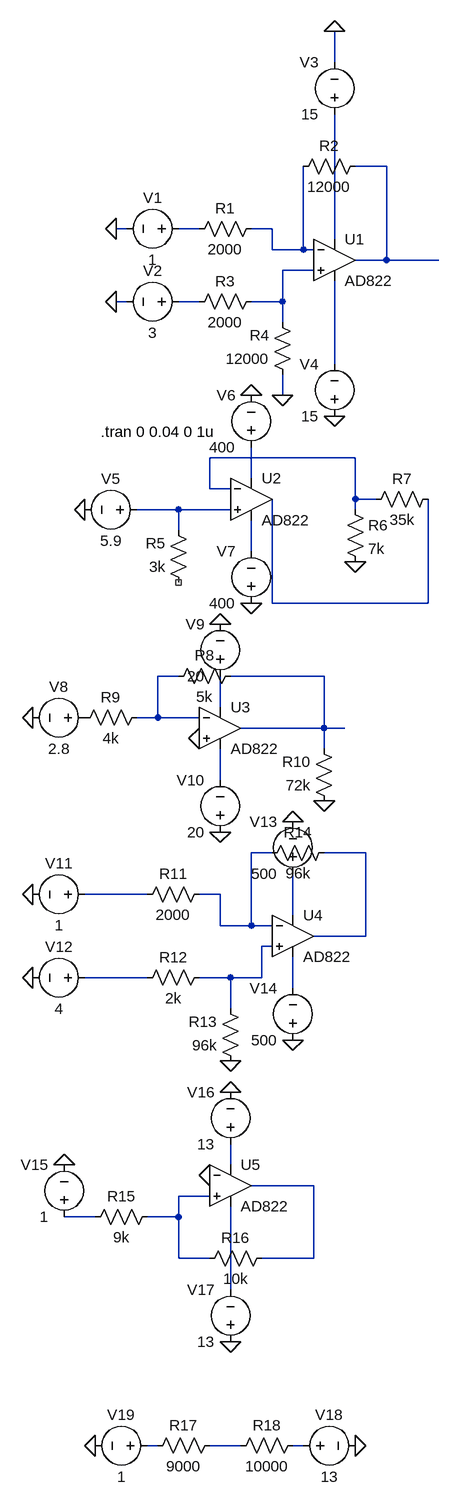
[diagram p0: schematic Draft1.asc]
Draft1.asc, the LTspice schematic file:
Version 4.1
SHEET 1 880 2000
WIRE 368 -192 368 -240
WIRE 448 -32 400 -32
WIRE 48 64 32 64
WIRE 160 64 128 64
WIRE 272 64 240 64
WIRE 368 80 368 -112
WIRE 272 96 272 64
WIRE 320 96 320 -32
WIRE 320 96 272 96
WIRE 336 96 320 96
WIRE 448 112 448 -32
WIRE 448 112 400 112
WIRE 528 112 448 112
WIRE 336 128 288 128
WIRE 48 176 32 176
WIRE 160 176 128 176
WIRE 288 176 288 128
WIRE 288 176 240 176
WIRE 288 208 288 176
WIRE 368 272 368 144
WIRE 288 320 288 288
WIRE 400 416 176 416
WIRE 240 448 240 400
WIRE 176 464 176 416
WIRE 208 464 176 464
WIRE 400 480 400 416
WIRE 432 480 400 480
WIRE 128 496 64 496
WIRE 208 496 128 496
WIRE 400 496 400 480
WIRE 128 528 128 496
WIRE 240 560 240 512
WIRE 272 640 272 480
WIRE 512 640 512 480
WIRE 512 640 272 640
WIRE 128 752 96 752
WIRE 352 752 208 752
WIRE 192 800 192 752
WIRE 96 816 96 752
WIRE 96 816 64 816
WIRE 160 816 96 816
WIRE 352 832 352 752
WIRE 352 832 224 832
WIRE 384 832 352 832
WIRE 352 864 352 832
WIRE 192 912 192 864
WIRE 272 1024 240 1024
WIRE 416 1024 352 1024
WIRE 80 1088 -16 1088
WIRE 192 1088 160 1088
WIRE 304 1120 304 1056
WIRE 192 1136 192 1088
WIRE 240 1136 240 1024
WIRE 240 1136 192 1136
WIRE 272 1136 240 1136
WIRE 416 1152 416 1024
WIRE 416 1152 336 1152
WIRE 272 1168 256 1168
WIRE 80 1216 -16 1216
WIRE 208 1216 160 1216
WIRE 256 1216 256 1168
WIRE 256 1216 208 1216
WIRE 304 1232 304 1184
WIRE 208 1264 208 1216
WIRE 208 1504 208 1472
WIRE 336 1536 240 1536
WIRE 176 1552 128 1552
WIRE 0 1584 -48 1584
WIRE 128 1584 128 1552
WIRE 128 1584 80 1584
WIRE 128 1648 128 1584
WIRE 176 1648 128 1648
WIRE 336 1648 336 1536
WIRE 336 1648 256 1648
WIRE 208 1696 208 1568
WIRE 96 1936 80 1936
WIRE 224 1936 176 1936
WIRE 320 1936 304 1936
FLAG 368 352 0
FLAG 368 -240 0
FLAG 32 64 0
FLAG 32 176 0
FLAG 288 320 0
FLAG -16 496 0
FLAG 400 576 0
FLAG 240 320 0
FLAG 240 640 0
FLAG 160 848 0
FLAG -96 816 0
FLAG 352 944 0
FLAG 192 672 0
FLAG 192 992 0
FLAG -96 1088 0
FLAG -96 1216 0
FLAG 208 1344 0
FLAG 304 976 0
FLAG 304 1312 0
FLAG 176 1520 0
FLAG 208 1776 0
FLAG 208 1392 0
FLAG -48 1504 0
FLAG 0 1936 0
FLAG 400 1936 0
SYMBOL voltage 144 64 R90
WINDOW 0 -32 56 VBottom 2
WINDOW 3 32 56 VTop 2
WINDOW 123 0 0 Left 0
WINDOW 39 0 0 Left 0
SYMATTR InstName V1
SYMATTR Value 1
SYMBOL voltage 144 176 R90
WINDOW 0 -32 56 VBottom 2
WINDOW 3 32 56 VTop 2
WINDOW 123 0 0 Left 0
WINDOW 39 0 0 Left 0
SYMATTR InstName V2
SYMATTR Value 3
SYMBOL res 256 160 R90
WINDOW 0 0 56 VBottom 2
WINDOW 3 32 56 VTop 2
SYMATTR InstName R3
SYMATTR Value 2000
SYMBOL res 256 48 R90
WINDOW 0 0 56 VBottom 2
WINDOW 3 32 56 VTop 2
SYMATTR InstName R1
SYMATTR Value 2000
SYMBOL res 304 304 R180
WINDOW 0 36 76 Left 2
WINDOW 3 36 40 Left 2
SYMATTR InstName R4
SYMATTR Value 12000
SYMBOL res 304 -16 R270
WINDOW 0 32 56 VTop 2
WINDOW 3 0 56 VBottom 2
SYMATTR InstName R2
SYMATTR Value 12000
SYMBOL OpAmps\\AD822 368 48 R0
SYMATTR InstName U1
SYMBOL voltage 368 -96 R180
WINDOW 0 24 96 Left 2
WINDOW 3 24 16 Left 2
WINDOW 123 0 0 Left 0
WINDOW 39 0 0 Left 0
SYMATTR InstName V3
SYMATTR Value 15
SYMBOL voltage 368 368 R180
WINDOW 0 24 96 Left 2
WINDOW 3 24 16 Left 2
WINDOW 123 0 0 Left 0
WINDOW 39 0 0 Left 0
SYMATTR InstName V4
SYMATTR Value 15
SYMBOL voltage 80 496 R90
WINDOW 0 -32 56 VBottom 2
WINDOW 3 32 56 VTop 2
SYMATTR InstName V5
SYMATTR Value 5.9
SYMBOL res 144 624 R180
WINDOW 0 36 76 Left 2
WINDOW 3 36 40 Left 2
SYMATTR InstName R5
SYMATTR Value 3k
SYMBOL OpAmps\\AD822 240 416 R0
SYMATTR InstName U2
SYMBOL res 384 480 R0
SYMATTR InstName R6
SYMATTR Value 7k
SYMBOL res 528 464 R90
WINDOW 0 0 56 VBottom 2
WINDOW 3 32 56 VTop 2
SYMATTR InstName R7
SYMATTR Value 35k
SYMBOL voltage 240 416 R180
WINDOW 0 24 96 Left 2
WINDOW 3 24 16 Left 2
SYMATTR InstName V6
SYMATTR Value 400
SYMBOL voltage 240 656 R180
WINDOW 0 24 96 Left 2
WINDOW 3 24 16 Left 2
SYMATTR InstName V7
SYMATTR Value 400
SYMBOL OpAmps\\AD822 192 768 R0
SYMATTR InstName U3
SYMBOL res 224 736 R90
WINDOW 0 0 56 VBottom 2
WINDOW 3 32 56 VTop 2
SYMATTR InstName R8
SYMATTR Value 5k
SYMBOL res 80 800 R90
WINDOW 0 0 56 VBottom 2
WINDOW 3 32 56 VTop 2
SYMATTR InstName R9
SYMATTR Value 4k
SYMBOL res 368 960 R180
WINDOW 0 36 76 Left 2
WINDOW 3 36 40 Left 2
SYMATTR InstName R10
SYMATTR Value 72k
SYMBOL voltage 0 816 R90
WINDOW 0 -32 56 VBottom 2
WINDOW 3 32 56 VTop 2
SYMATTR InstName V8
SYMATTR Value 2.8
SYMBOL voltage 192 768 R180
WINDOW 0 24 96 Left 2
WINDOW 3 24 16 Left 2
SYMATTR InstName V9
SYMATTR Value 20
SYMBOL voltage 192 1008 R180
WINDOW 0 24 96 Left 2
WINDOW 3 24 16 Left 2
SYMATTR InstName V10
SYMATTR Value 20
SYMBOL voltage 0 1088 R90
WINDOW 0 -32 56 VBottom 2
WINDOW 3 32 56 VTop 2
SYMATTR InstName V11
SYMATTR Value 1
SYMBOL voltage 0 1216 R90
WINDOW 0 -32 56 VBottom 2
WINDOW 3 32 56 VTop 2
SYMATTR InstName V12
SYMATTR Value 4
SYMBOL res 176 1072 R90
WINDOW 0 0 56 VBottom 2
WINDOW 3 32 56 VTop 2
SYMATTR InstName R11
SYMATTR Value 2000
SYMBOL res 176 1200 R90
WINDOW 0 0 56 VBottom 2
WINDOW 3 32 56 VTop 2
SYMATTR InstName R12
SYMATTR Value 2k
SYMBOL res 224 1360 R180
WINDOW 0 36 76 Left 2
WINDOW 3 36 40 Left 2
SYMATTR InstName R13
SYMATTR Value 96k
SYMBOL res 256 1040 R270
WINDOW 0 32 56 VTop 2
WINDOW 3 0 56 VBottom 2
SYMATTR InstName R14
SYMATTR Value 96k
SYMBOL OpAmps\\AD822 304 1088 R0
SYMATTR InstName U4
SYMBOL voltage 304 1072 R180
WINDOW 0 24 96 Left 2
WINDOW 3 24 16 Left 2
SYMATTR InstName V13
SYMATTR Value 500
SYMBOL voltage 304 1328 R180
WINDOW 0 24 96 Left 2
WINDOW 3 24 16 Left 2
SYMATTR InstName V14
SYMATTR Value 500
SYMBOL voltage -48 1600 R180
WINDOW 0 24 96 Left 2
WINDOW 3 24 16 Left 2
SYMATTR InstName V15
SYMATTR Value 1
SYMBOL OpAmps\\AD822 208 1472 R0
SYMATTR InstName U5
SYMBOL res 96 1568 R90
WINDOW 0 0 56 VBottom 2
WINDOW 3 32 56 VTop 2
SYMATTR InstName R15
SYMATTR Value 9k
SYMBOL res 272 1632 R90
WINDOW 0 0 56 VBottom 2
WINDOW 3 32 56 VTop 2
SYMATTR InstName R16
SYMATTR Value 10k
SYMBOL voltage 208 1488 R180
WINDOW 0 24 96 Left 2
WINDOW 3 24 16 Left 2
SYMATTR InstName V16
SYMATTR Value 13
SYMBOL voltage 208 1792 R180
WINDOW 0 24 96 Left 2
WINDOW 3 24 16 Left 2
SYMATTR InstName V17
SYMATTR Value 13
SYMBOL voltage 304 1936 R270
WINDOW 0 32 56 VTop 2
WINDOW 3 -32 56 VBottom 2
SYMATTR InstName V18
SYMATTR Value 13
SYMBOL voltage 96 1936 R90
WINDOW 0 -32 56 VBottom 2
WINDOW 3 32 56 VTop 2
SYMATTR InstName V19
SYMATTR Value 1
SYMBOL res 192 1920 R90
WINDOW 0 0 56 VBottom 2
WINDOW 3 32 56 VTop 2
SYMATTR InstName R17
SYMATTR Value 9000
SYMBOL res 320 1920 R90
WINDOW 0 0 56 VBottom 2
WINDOW 3 32 56 VTop 2
SYMATTR InstName R18
SYMATTR Value 10000
TEXT 8 376 Left 2 !.tran 0 0.04 0 1u

The netlist it stands for:
* Draft1.asc
V1 N002 0 1
V2 N006 0 3
R3 N005 N006 2000
R1 N003 N002 2000
R4 0 N005 12000
R2 N003 N001 12000
X§U1 N005 N003 N004 N007 N001 AD822  ; pins In+ In- V+ V- OUT
V3 N004 0 15
V4 0 N007 15
V5 N010 0 5.9
R5 NC_01 N010 3k
X§U2 N010 N008 N009 N011 N012 AD822  ; pins In+ In- V+ V- OUT
R6 N008 0 7k
R7 N012 N008 35k
V6 N009 0 400
V7 0 N011 400
X§U3 0 N013 N015 N016 N014 AD822  ; pins In+ In- V+ V- OUT
R8 N014 N013 5k
R9 N013 P001 4k
R10 0 N014 72k
V8 P001 0 2.8
V9 N015 0 20
V10 0 N016 20
V11 N019 0 1
V12 N022 0 4
R11 N017 N019 2000
R12 N021 N022 2k
R13 0 N021 96k
R14 N017 N018 96k
X§U4 N021 N017 N020 N023 N018 AD822  ; pins In+ In- V+ V- OUT
V13 N020 0 500
V14 0 N023 500
V15 N027 0 1
X§U5 N026 0 N024 N028 N025 AD822  ; pins In+ In- V+ V- OUT
R15 N026 N027 9k
R16 N025 N026 10k
V16 N024 0 13
V17 0 N028 13
V18 N031 0 13
V19 N029 0 1
R17 N030 N029 9000
R18 N031 N030 10000
.tran 0 0.04 0 1u
.backanno
.end